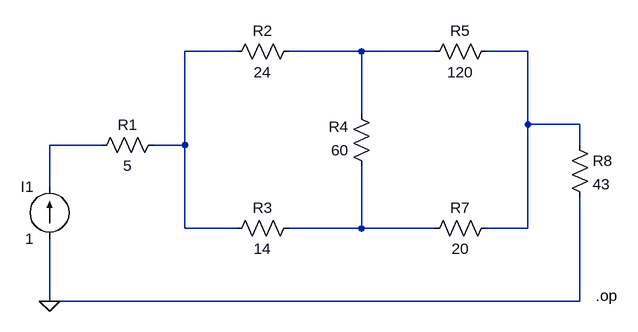
[diagram p0: schematic Lab07P01E.asc]
Lab07P01E.asc, the LTspice schematic file:
Version 4
SHEET 1 1988 680
WIRE 336 -96 256 -96
WIRE 528 -96 416 -96
WIRE 640 -96 528 -96
WIRE 784 -96 720 -96
WIRE 528 0 528 -96
WIRE 784 16 784 -96
WIRE 864 16 784 16
WIRE 128 48 48 48
WIRE 256 48 256 -96
WIRE 256 48 208 48
WIRE 864 48 864 16
WIRE 48 112 48 48
WIRE 256 176 256 48
WIRE 336 176 256 176
WIRE 528 176 528 80
WIRE 528 176 416 176
WIRE 640 176 528 176
WIRE 784 176 784 16
WIRE 784 176 720 176
WIRE 48 288 48 192
WIRE 864 288 864 128
WIRE 864 288 48 288
FLAG 48 288 0
DATAFLAG 48 48 ""
SYMBOL current 48 192 R180
WINDOW 0 24 80 Left 2
WINDOW 3 24 0 Left 2
SYMATTR InstName I1
SYMATTR Value 1
SYMBOL res 224 32 R90
WINDOW 0 0 56 VBottom 2
WINDOW 3 32 56 VTop 2
SYMATTR InstName R1
SYMATTR Value 5
SYMBOL res 432 -112 R90
WINDOW 0 0 56 VBottom 2
WINDOW 3 32 56 VTop 2
SYMATTR InstName R2
SYMATTR Value 24
SYMBOL res 432 160 R90
WINDOW 0 0 56 VBottom 2
WINDOW 3 32 56 VTop 2
SYMATTR InstName R3
SYMATTR Value 14
SYMBOL res 544 96 R180
WINDOW 0 36 76 Left 2
WINDOW 3 36 40 Left 2
SYMATTR InstName R4
SYMATTR Value 60
SYMBOL res 624 -80 R270
WINDOW 0 32 56 VTop 2
WINDOW 3 0 56 VBottom 2
SYMATTR InstName R5
SYMATTR Value 120
SYMBOL res 624 192 R270
WINDOW 0 32 56 VTop 2
WINDOW 3 0 56 VBottom 2
SYMATTR InstName R7
SYMATTR Value 20
SYMBOL res 848 32 R0
SYMATTR InstName R8
SYMATTR Value 43
TEXT 888 280 Left 2 !.op

The netlist it stands for:
* Lab07P01E.asc
I1 0 N004 1
R1 N001 N004 5
R2 N002 N001 24
R3 N005 N001 14
R4 N005 N002 60
R5 N002 N003 120
R7 N005 N003 20
R8 N003 0 43
.op
.backanno
.end